# EAGLE design ESP (EAGLE 7.6.0)
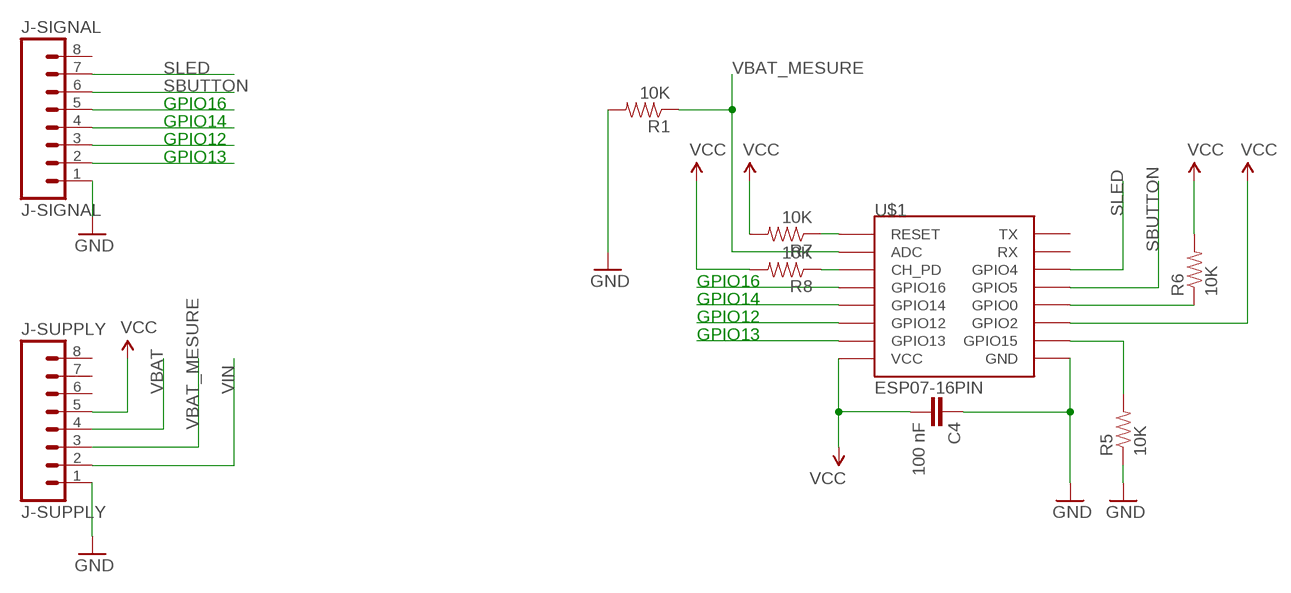
[diagram p0: schematic, sheet 1]

## Parts
C4  100 nF  CAP1206  [1206]
J-SIGNAL  J-SIGNAL  M08  [1X08_ROUND]
J-SUPPLY  J-SUPPLY  M08  [1X08_ROUND]
R1  10K  RESISTOR0805-RES  [0805]
R5  10K  RESISTOR0805-RES  [0805]
R6  10K  RESISTOR0805-RES  [0805]
R7  10K  RESISTOR0805-RES  [0805]
R8  10K  RESISTOR0805-RES  [0805]
U$1  ESP07-16PIN  [ESP07-16PIN]

## Nets
GND: C4.1 J-SIGNAL.1 J-SUPPLY.1 R1.2 R5.1 U$1.GND
GPIO12: J-SIGNAL.3 U$1.GPIO12
GPIO13: J-SIGNAL.2 U$1.GPIO13
GPIO14: J-SIGNAL.4 U$1.GPIO14
GPIO16: J-SIGNAL.5 U$1.GPIO16
N$1: R5.2 U$1.GPIO15
N$6: R6.1 U$1.GPIO0
N$9: R7.1 U$1.REST(RESET)
N$10: R8.1 U$1.CH_PD
SBUTTON: J-SIGNAL.6 U$1.GPIO5
SLED: J-SIGNAL.7 U$1.GPIO4
VBAT [SUPPLY]: J-SUPPLY.4
VBAT_MESURE [SUPPLY]: J-SUPPLY.3 R1.1 U$1.ADC
VCC [SUPPLY]: C4.2 J-SUPPLY.5 R6.2 R7.2 R8.2 U$1.GPIO2 U$1.VCC
VIN [SUPPLY]: J-SUPPLY.2
Unconnected: J-SIGNAL.8 J-SUPPLY.6 J-SUPPLY.7 J-SUPPLY.8 U$1.RX U$1.TX

## Notes on the sheet
- GPIO16
- GPIO14
- GPIO12
- GPIO13
- GPIO16
- GPIO14
- GPIO12
- GPIO13

## Library data of the parts
C4 = SparkFun-Capacitors:CAP: Capacitor Standard 0603 ceramic capacitor, and 0.1" leaded capacitor.
J-SIGNAL J-SUPPLY = SparkFun-Connectors:M08: Header 8 Standard 8-pin 0.1" header. Use with straight break away headers (SKU : PRT-00116), right angle break away headers (PRT-00553), swiss pins (PRT-00743), machine pins (PRT-00117), and female headers (PRT-00115).; PROD_ID: CONN-08437
R1 R5-R8 = SparkFun-Passives:RESISTOR: Resistor Basic schematic elements and footprints for 0603, 1206, and PTH resistors.
U$1 = esp8266modules:ESP07-16PIN: ESP8266 Wifi module 07 - 16 pins; DIMENSIONS: 22.0 x 16.0 mm; PINS: 16; PITCH: 0.078" / 2 mm

## Net classes
0 default: width 0.3 mm
1 GND: width 0.5 mm, clearance 0.5 mm
2 SUPPLY: width 0.5 mm, clearance 0.003 mm

## Board
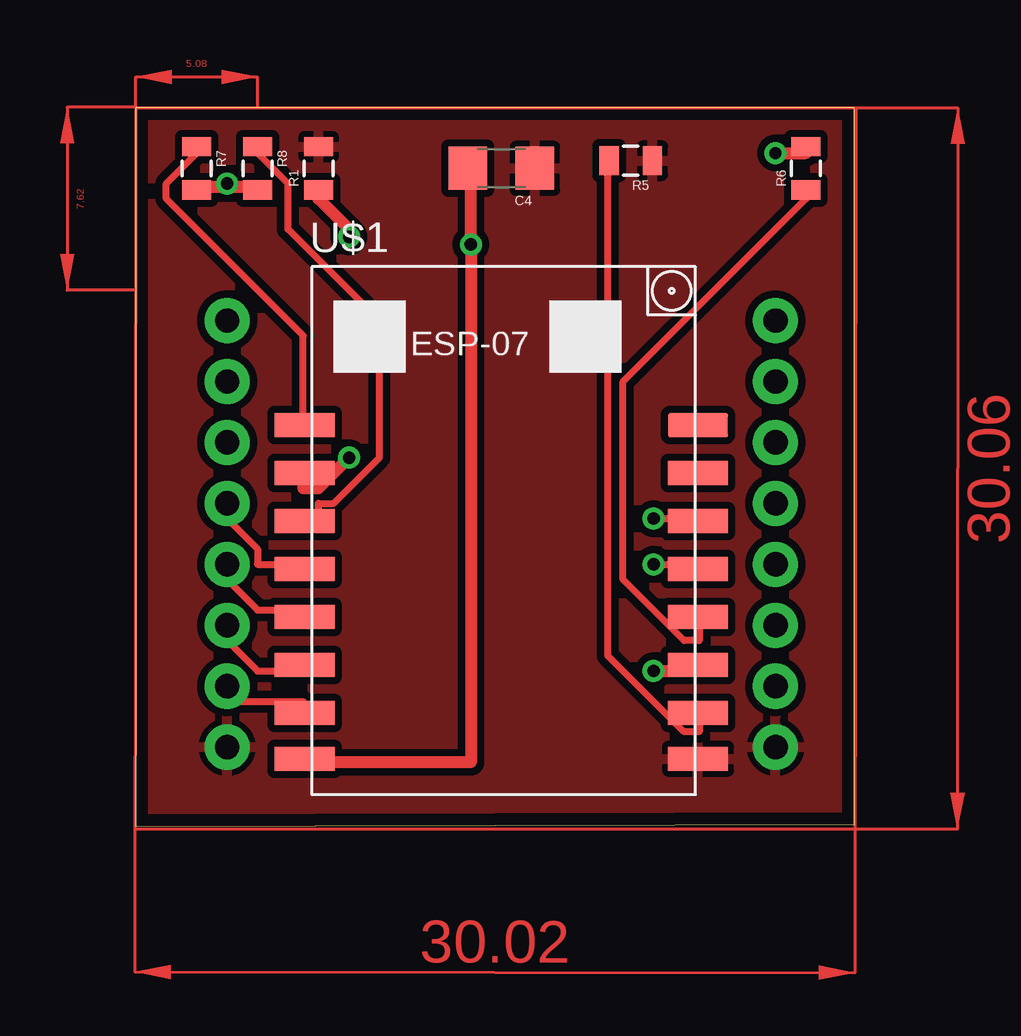
[diagram p1: board, top side]
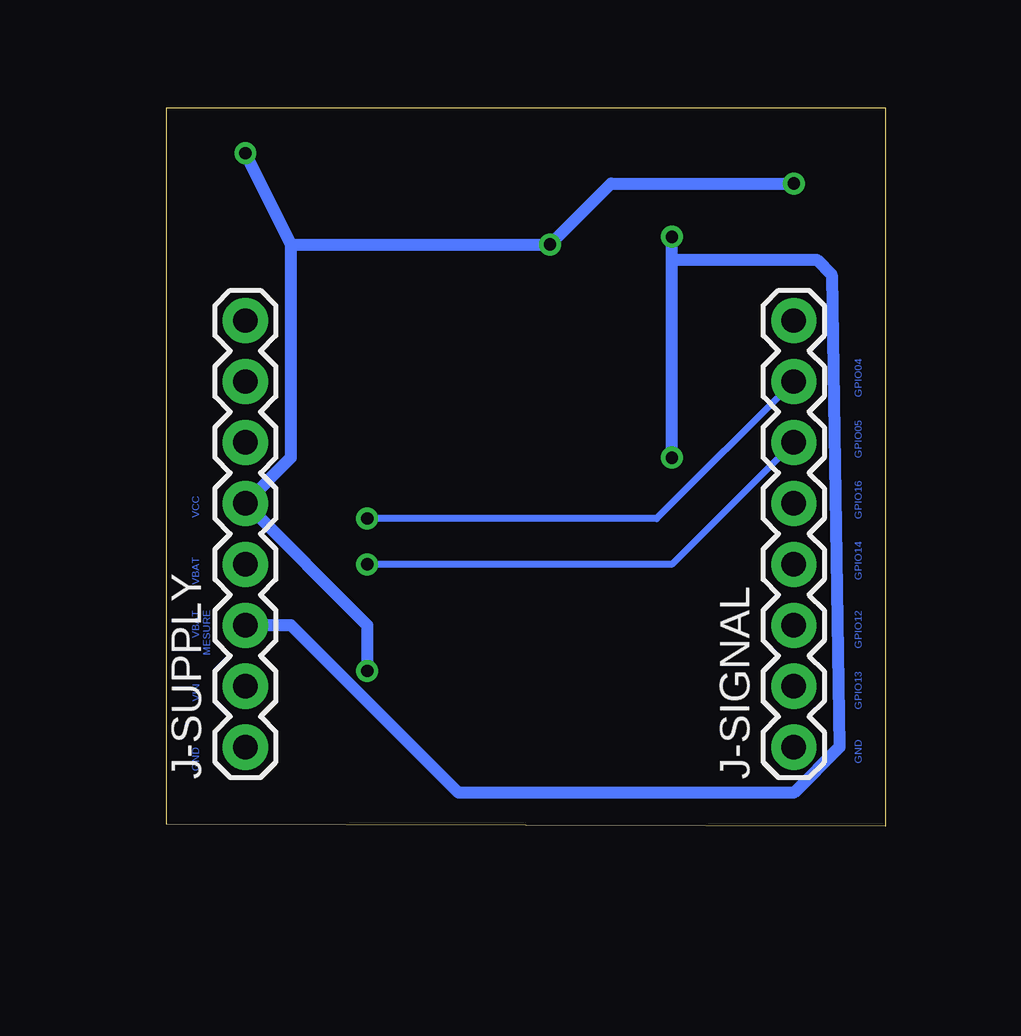
[diagram p2: board, bottom side, seen from below]

Size 29.96 x 29.97 mm. Coordinates in mm from the lower left corner, seen from the top.
Outline: 0,0 29.96,0.09 29.96,29.97 0,29.97 0,0
Copper layers (1*16): Top 0.035mm / dielectric 1.5mm / Bottom 0.035mm
Design rules "DRC": minimum track width 10mil, minimum drill 20mil, track to track 4mil, track to pad 4mil, pad to pad 2mil, via to via 2mil, smd to smd 2mil, copper to edge 20mil, drill to drill 8mil, minimum pad ring 10mil, minimum via ring 8mil, stop-mask expansion 4mil, vias tented up to drill 0mil, thermal gap 10mil

### Footprints (pad centres in the part's own frame; a part is rotated, then mirrored left to right if it is on the bottom)
1206 = smd 1.6 x 1.8: 1 -1.4,0; 2 1.4,0
1X08_ROUND = drill 1.016 pad 1.88: 1 0,0; 2 2.54,0; 3 5.08,0; 4 7.62,0; 5 10.16,0; 6 12.7,0; 7 15.24,0; 8 17.78,0
0805 = smd 0.8 x 1.2: 1 -0.9,0; 2 0.9,0
ESP07-16PIN = smd 2.5 x 1: ADC -8.2,3.8; CH_PD -8.2,1.8; GND 8.2,-8.105; GPIO0 8.2,-2.2; GPIO2 8.2,-4.2; GPIO4 8.2,1.8; GPIO5 8.2,-0.2; GPIO12 -8.2,-4.2; GPIO13 -8.2,-6.2; GPIO14 -8.2,-2.2; GPIO15 8.2,-6.2; GPIO16 -8.2,-0.2; REST -8.2,5.8; RX 8.2,3.8; TX 8.2,5.8; VCC -8.2,-8.105

### Placement (x,y rotation side)
C4  15.24,27.44 180 top
J-SIGNAL  3.81,3.31 90 bottom
J-SUPPLY  26.67,3.31 90 bottom
R1  7.62,27.44 90 top
R5  20.64,27.76 180 top
R6  27.94,27.44 90 top
R7  2.54,27.44 270 top
R8  5.08,27.44 270 top
U$1  15.24,10.93 0 top

### Tracks (layer width: path | path; a pad name or v marks a point on that pad's centre or on a via)
GND
  pour Top (isolate 0.305, rank 2): 0,29.98 30.48,29.98 30.48,-0.5 0,-0.5
GPIO12
  Top 0.3: J-SIGNAL.3 3.81,7.76 5.08,6.49 6.98,6.49 U$1.GPIO12
GPIO13
  Top 0.3: J-SIGNAL.2 3.81,5.22 6.98,5.22 U$1.GPIO13
GPIO14
  Top 0.3: J-SIGNAL.4 3.81,10.3 5.08,9.03 6.98,9.03 U$1.GPIO14
GPIO16
  Top 0.3: J-SIGNAL.5 3.81,12.84 5.08,11.57 5.08,10.93 6.98,10.93 U$1.GPIO16
N$1
  Top 0.3: 19.69,28.08 19.69,27.44 19.69,7.12 22.86,3.95 23.5,3.95 23.5,4.58 U$1.GPIO15
  Top 0.508: R5.2 19.69,27.76 19.69,27.44
N$6
  Top 0.3: R6.1 27.94,26.17 20.32,18.55 20.32,10.3 22.86,7.76 23.5,7.76 23.5,8.39 U$1.GPIO0
N$9
  Top 0.3: 2.54,28.24 R7.1 2.54,28.08 1.27,26.81 1.27,26.17 6.98,20.46 6.98,16.65 U$1.REST 7.14,16.81
N$10
  Top 0.3: R8.1 5.08,28.08 6.35,26.81 6.35,24.9 10.16,21.09 10.16,15.38 8.26,13.47 7.62,13.47 7.62,12.84 U$1.CH_PD
SBUTTON  (via drill 0.51)
  Top 0.3: v21.59,10.93 22.86,10.93 U$1.GPIO5
  Bottom 0.3: v21.59,10.93 8.89,10.93 J-SIGNAL.6
SLED  (via drill 0.51)
  Top 0.3: v21.59,12.84 22.86,12.84 U$1.GPIO4
  Bottom 0.3: v21.59,12.84 9.52,12.84 J-SIGNAL.7
VBAT_MESURE  (via drill 0.51)
  Top 0.5: v8.89,24.59 8.89,24.9 7.62,26.17 R1.1 | v8.89,15.38 7.62,14.11 6.98,14.11 6.98,14.74 U$1.ADC
  Bottom 0.5: v8.89,15.38 8.89,23.63 | 8.89,23.63 v8.89,24.59 | J-SUPPLY.3 24.77,8.39 17.78,1.41 3.81,1.41 1.91,3.31 2.22,23 2.86,23.63 8.89,23.63
VCC  (via drill 0.51)
  Top 0.5: 3.81,26.65 5.08,26.65 R8.2 | 3.81,26.65 2.54,26.65 R7.2 | v26.67,28.08 27.94,28.08 R6.2 | C4.2 13.97,27.44 v13.97,24.27 13.97,2.68 7.62,2.68 U$1.VCC | v3.81,26.81 3.81,26.65 | v21.59,6.49 22.86,6.49 U$1.GPIO2
  Bottom 0.5: v26.67,28.08 24.77,24.27 v13.97,24.27 11.43,26.81 v3.81,26.81 | 24.77,21.09 24.77,15.38 J-SUPPLY.5 21.59,8.39 v21.59,6.49
  Bottom 0.508: 24.77,21.09 24.77,24.27
(copper drawn outside any net)
  shapes: Top area x4

### Text on the board
Bottom: GPIO04 | GPIO05 | GPIO16 | VCC | GPIO14 | VBAT | GPIO12 | VBAT / MESURE | GPIO13 | VIN | GND | GND